# EAGLE design RFID-Feather (EAGLE 9.5.2)
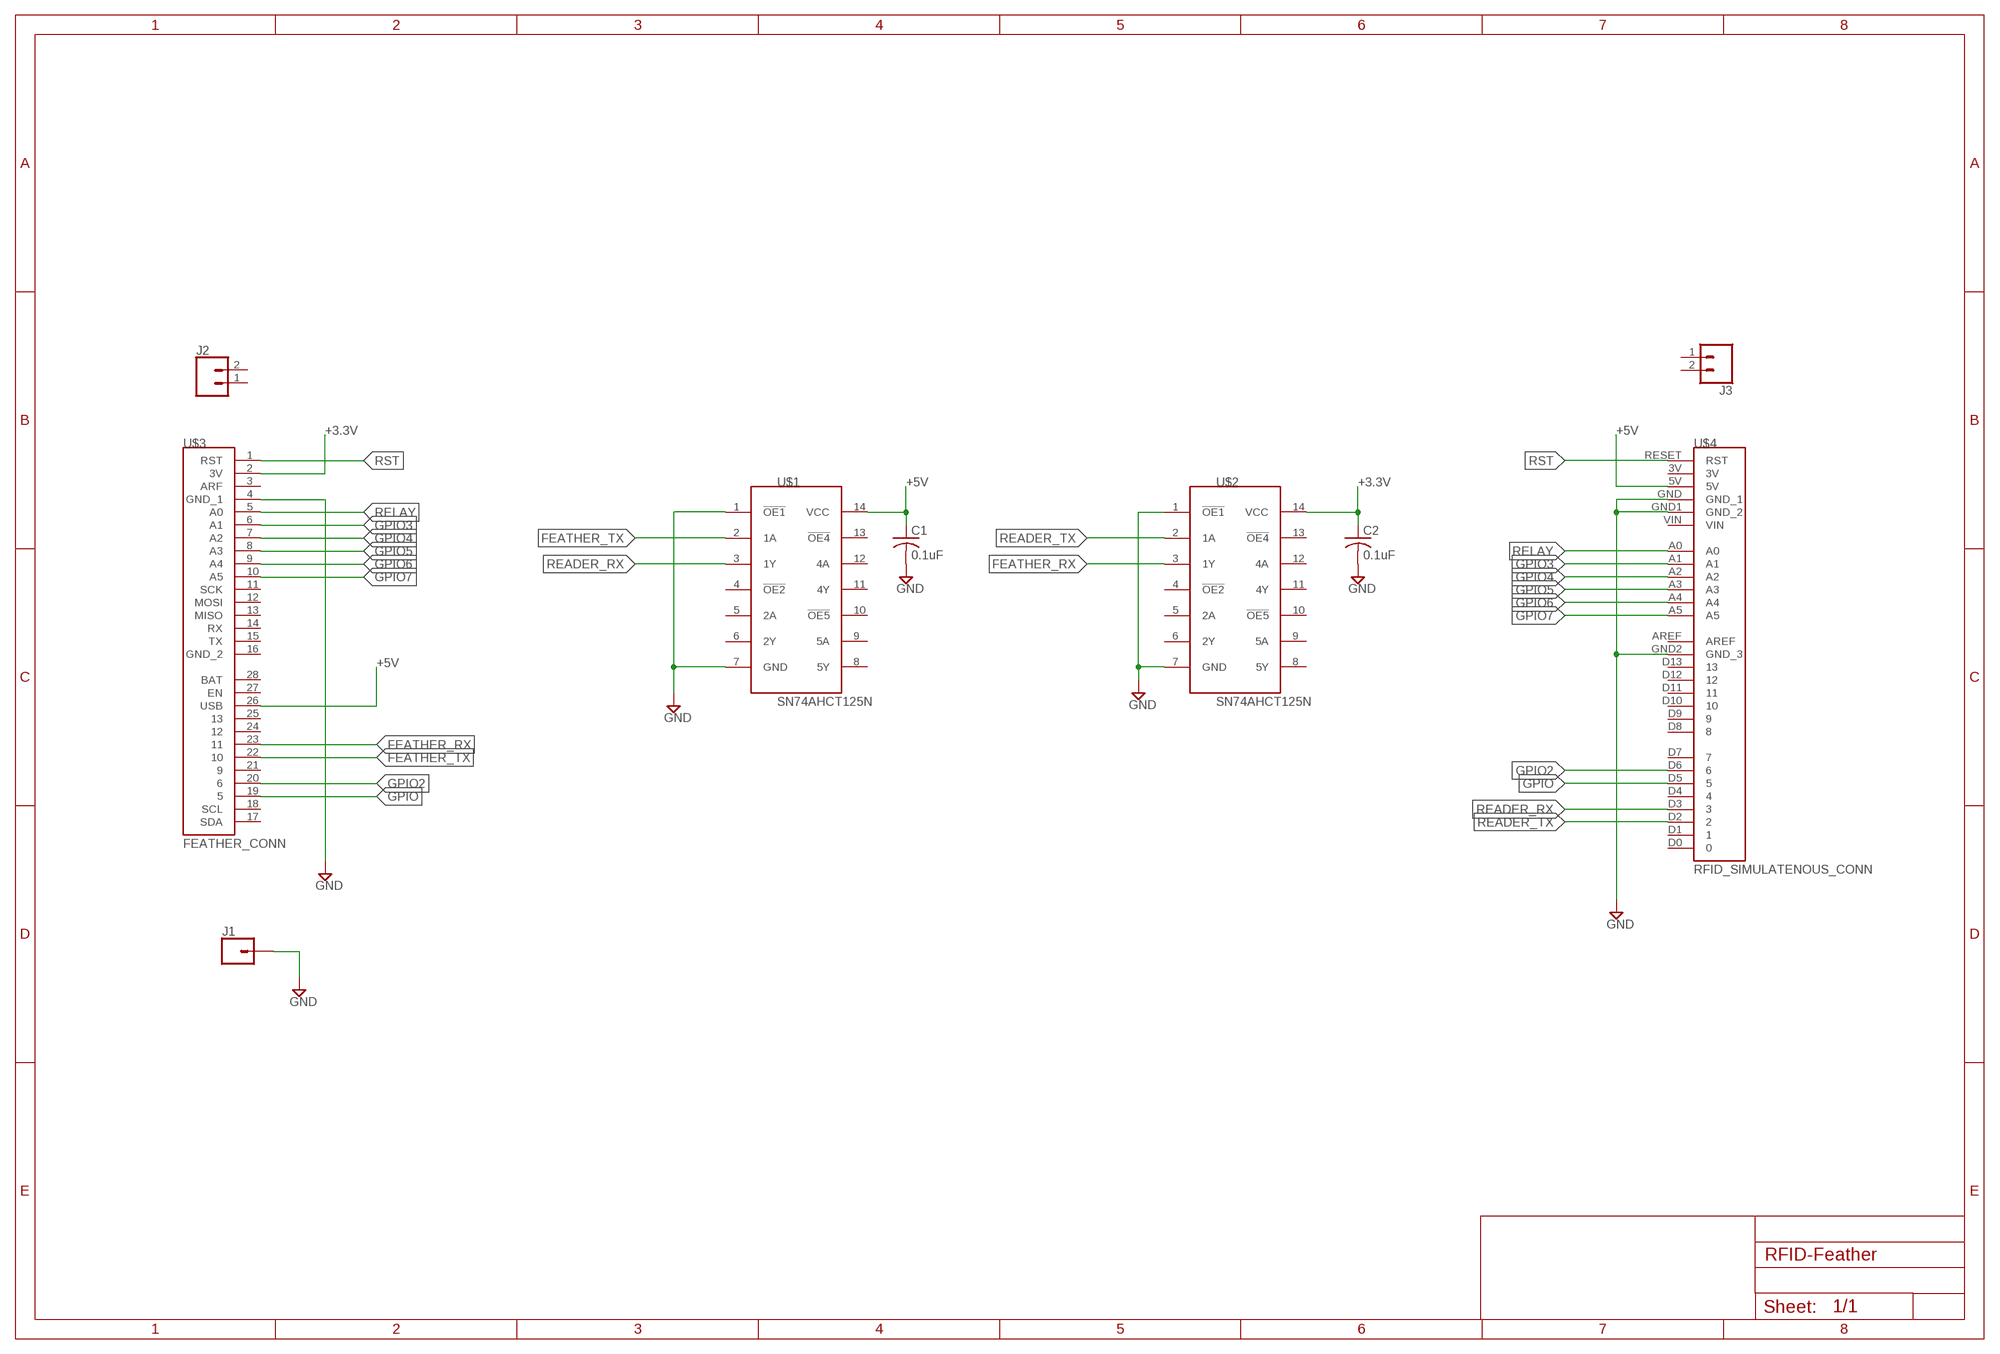
[diagram p0: schematic, sheet 1]

## Parts
C1  0.1uF  C-USC0805K  [C0805K]
C2  0.1uF  C-USC0805K  [C0805K]
J1  CONN_01PTH_2MM  [1X01_2MM]
J2  CONN_02  [1X02]
J3  CONN_02  [1X02]
U$1  SN74AHCT125N  [DIP254P762X508-14P]
U$2  SN74AHCT125N  [DIP254P762X508-14P]
U$3  FEATHER_CONN  [FEATHERWING]
U$4  RFID_SIMULATENOUS_CONN  [ARDUINO]

## Nets
+3.3V: C2.1 U$2.14(VCC) U$3.2(3V)
+5V: C1.1 U$1.14(VCC) U$3.26(USB) U$4.5V
FEATHER_RX: U$2.3(1Y) U$3.23
FEATHER_TX: U$1.2(1A) U$3.22
GND: C1.2 C2.2 J1.1 U$1.1(!OE1) U$1.7(GND) U$2.1(!OE1) U$2.7(GND) U$3.4(GND_1) U$4.GND1(GND_2) U$4.GND2(GND_3) U$4.GND(GND_1)
GPIO: U$3.19 U$4.D5
GPIO2: U$3.20 U$4.D6
GPIO3: U$3.6(A1) U$4.A1
GPIO4: U$3.7(A2) U$4.A2
GPIO5: U$3.8(A3) U$4.A3
GPIO6: U$3.9(A4) U$4.A4
GPIO7: U$3.10(A5) U$4.A5
READER_RX: U$1.3(1Y) U$4.D3
READER_TX: U$2.2(1A) U$4.D2
RELAY: U$3.5(A0) U$4.A0
RST: U$3.1(RST) U$4.RESET(RST)
Unconnected: J2.1 J2.2 J3.1 J3.2 U$1.4(!OE2) U$1.5(2A) U$1.6(2Y) U$1.8(5Y) U$1.9(5A) U$1.10(!OE5) U$1.11(4Y) U$1.12(4A) U$1.13(!OE4) U$2.4(!OE2) U$2.5(2A) U$2.6(2Y) U$2.8(5Y) U$2.9(5A) U$2.10(!OE5) U$2.11(4Y) U$2.12(4A) U$2.13(!OE4) U$3.3(ARF) U$3.11(SCK) U$3.12(MOSI) U$3.13(MISO) U$3.14(RX) U$3.15(TX) U$3.16(GND_2) U$3.17(SDA) U$3.18(SCL) U$3.21 U$3.24 U$3.25 U$3.27(EN) U$3.28(BAT) U$4.3V U$4.AREF U$4.D0 U$4.D1 U$4.D4 U$4.D7 U$4.D8 U$4.D9 U$4.D10 U$4.D11 U$4.D12 U$4.D13 U$4.VIN

## Library data of the parts
C1 C2 = adafruit:C-US: CAPACITOR, American symbol
J1 = SparkFun-Connectors:CONN_01: Single connection point. Often used as Generic Header-pin footprint for 0.1 inch spaced/style header connections On any of the 0.1 inch spaced packages, you can populate with these: Break Away Headers - Straight <https://www.sparkfun.com/products/116> (PRT-00116) Break Away Male Headers - Right Angle <https://www.sparkfun.com/products/553> (PRT-00553) Female Headers <https://www.sparkfun.com/products/115> (PRT-00115) Break Away Headers - Machine Pin <https://www.sparkfun.com/products/117> (PRT-00117) Break Away Female Headers - Swiss Machine Pin <https://www.sparkfun.com/products/743> (PRT-00743) This device is also useful as a general connection point to wire up your design to another part of your project. Our various solder wires solder well into these plated through hole pads. Hook-Up Wire - Assortment (Stranded, 22 AWG) <https://www.sparkfun.com/products/11375> (PRT-11375) Hook-Up Wire - Assortment (Solid Core, 22 AWG) <https://www.sparkfun.com/products/11367> (PRT-11367) View the entire wire category on our website here <https://www.sparkfun.com/categories/141> Special notes: SMTSO-256-ET is a "flush mount" nut for a 4-40 screw. We mostly use this on specialty testbeds; it is a nice way to connect hardware to your PCB at an adjustable hieght. Also note, the SNAP packages are for using a snappable style connector. We sell a baggie of snaps and they are also used on two LilyPad designs: Snap Assortment - 30 pack (male and female) <https://www.sparkfun.com/products/11347> (DEV-11347) LilyPad Arduino SimpleSnap <https://www.sparkfun.com/products/10941> (DEV-10941) LilyPad SimpleSnap Protoboard <https://www.sparkfun.com/products/10940> (DEV-10940)
J2 J3 = SparkFun-Connectors:CONN_02: Multi connection point. Often used as Generic Header-pin footprint for 0.1 inch spaced/style header connections On any of the 0.1 inch spaced packages, you can populate with these: Break Away Headers - Straight <https://www.sparkfun.com/products/116> (PRT-00116) Break Away Male Headers - Right Angle <https://www.sparkfun.com/products/553> (PRT-00553) Female Headers <https://www.sparkfun.com/products/115> (PRT-00115) Break Away Headers - Machine Pin <https://www.sparkfun.com/products/117> (PRT-00117) Break Away Female Headers - Swiss Machine Pin <https://www.sparkfun.com/products/743> (PRT-00743) For SCREWTERMINALS and SPRING TERMINALS visit here: Screw Terimnals on SparkFun.com <https://www.sparkfun.com/search/results?term=Screw+Terminals> (5mm/3.5mm/2.54mm spacing) This device is also useful as a general connection point to wire up your design to another part of your project. Our various solder wires solder well into these plated through hole pads. Hook-Up Wire - Assortment (Stranded, 22 AWG) <https://www.sparkfun.com/products/11375> (PRT-11375) Hook-Up Wire - Assortment (Solid Core, 22 AWG) <https://www.sparkfun.com/products/11367> (PRT-11367) View the entire wire category on our website here <https://www.sparkfun.com/categories/141> Special notes: Molex polarized connector foot print use with: PRT-08233 with associated crimp pins and housings. 2.54_SCREWTERM for use with PRT-10571. 3.5mm Screw Terminal footprints for PRT-08084 5mm Screw Terminal footprints for use with PRT-08432
U$1 U$2 = DIP254P762X508-14P:SN74AHCT125N
U$3 = FEATHER_FOOTPRINT:FEATHER_CONN
U$4 = FEATHER_FOOTPRINT:RFID_SIMULATENOUS_CONN

## Board
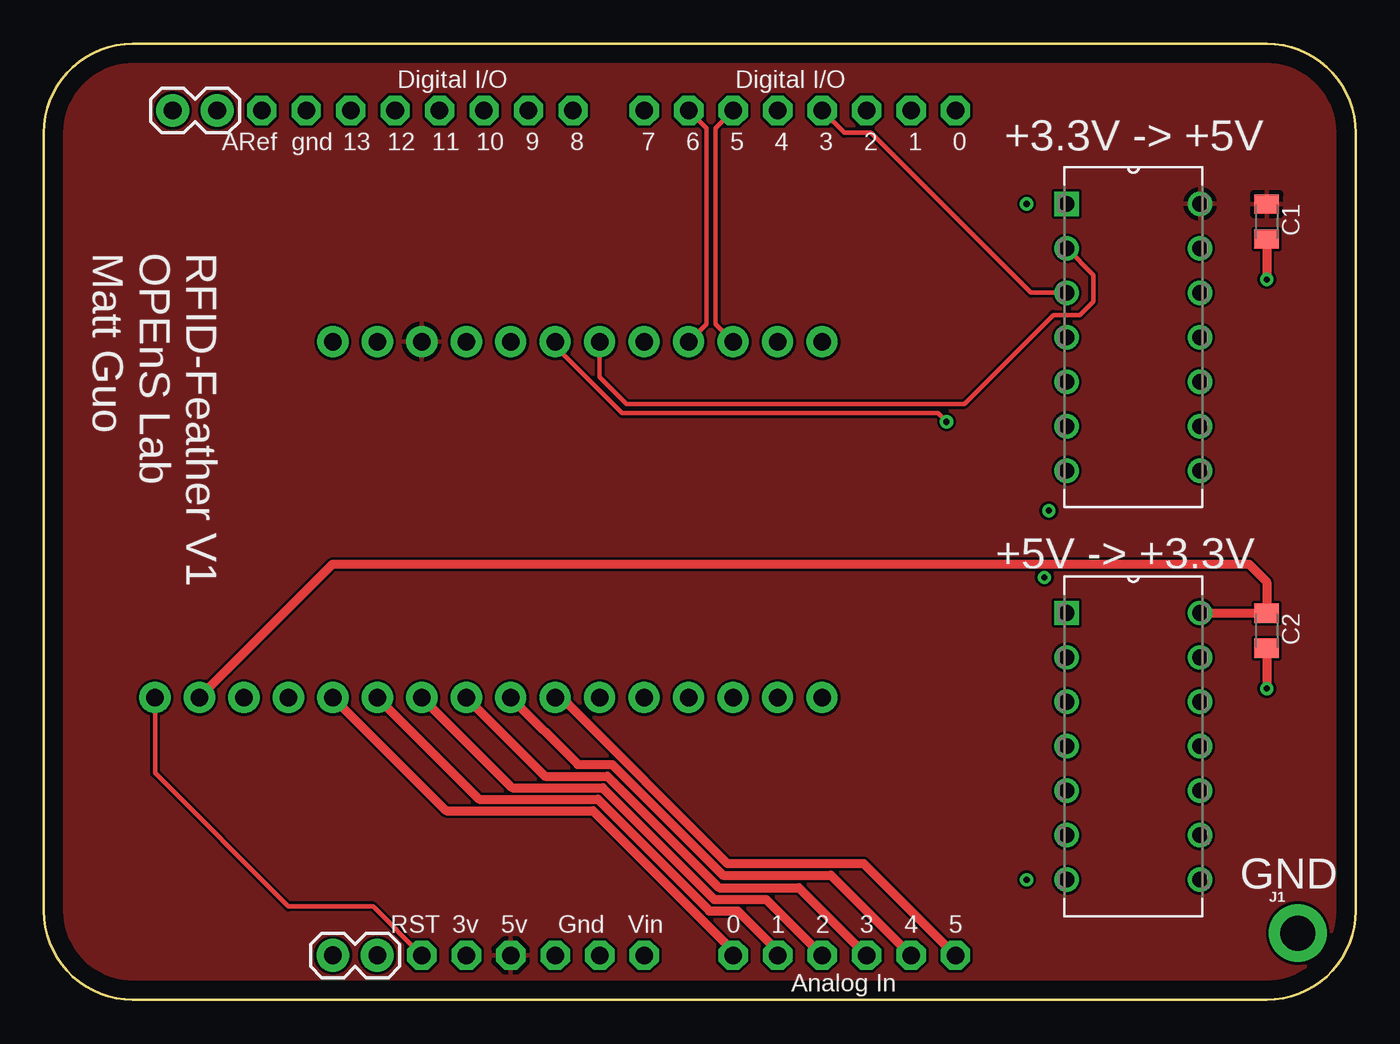
[diagram p1: board, top side]
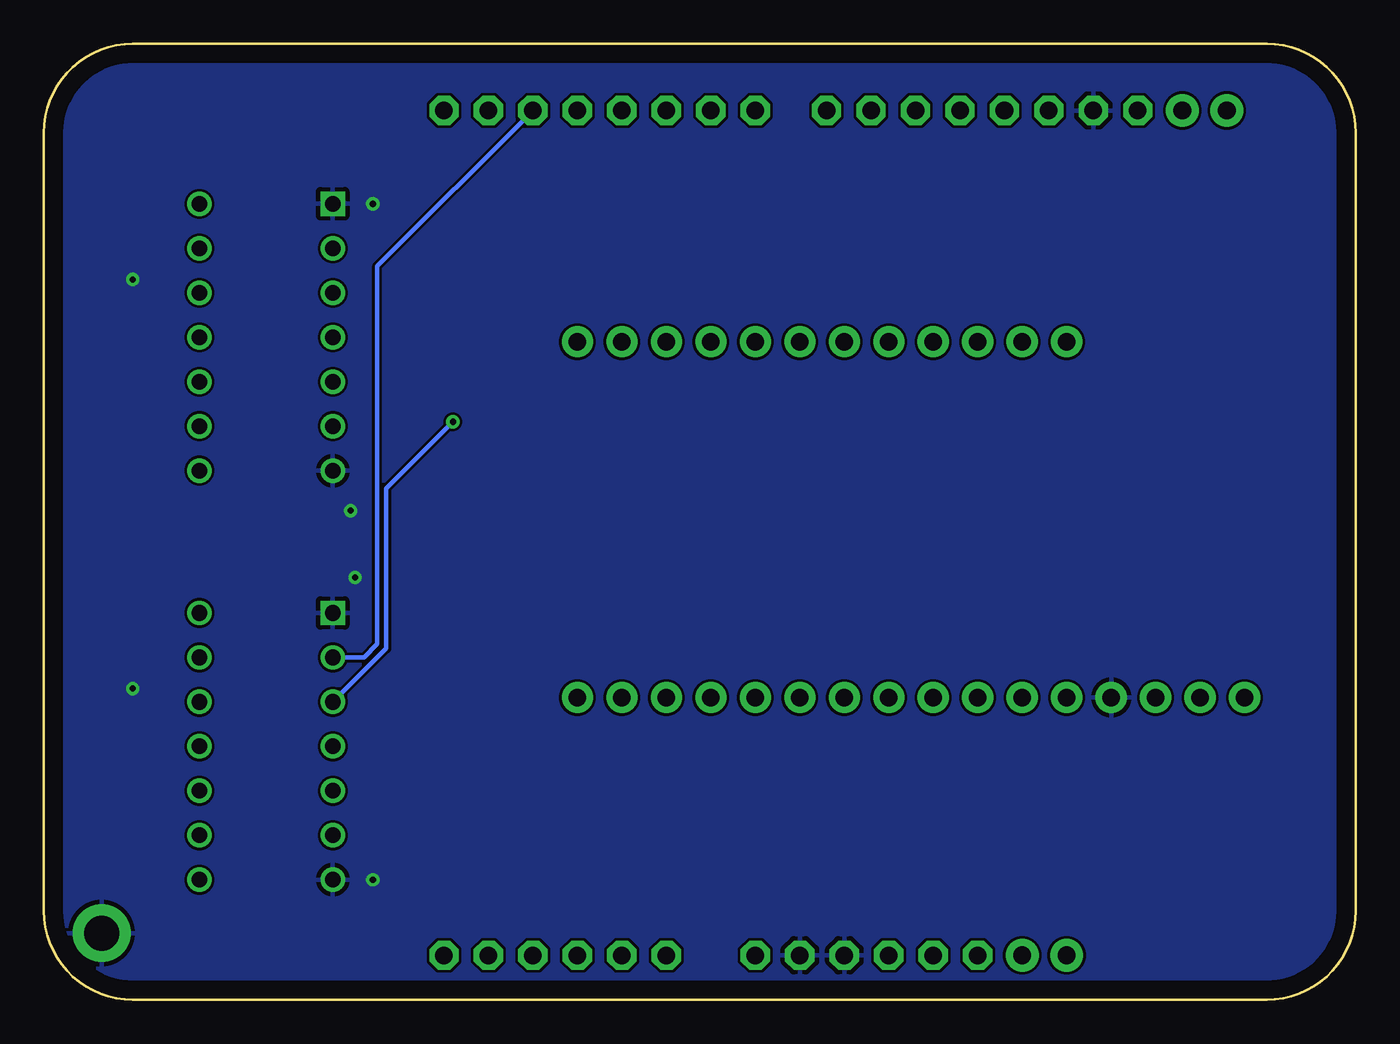
[diagram p2: board, bottom side, seen from below]

Size 74.93 x 54.61 mm. Coordinates in mm from the lower left corner, seen from the top.
Outline: 69.85,0 arc90 74.93,5.08 74.93,49.53 arc90 69.85,54.61 5.08,54.61 arc90 0,49.53 0,5.08 arc90 5.08,0 69.85,0
Copper layers (1*16): Top 0.035mm / dielectric 1.5mm / Bottom 0.035mm
Design rules "default *": minimum track width 6mil, minimum drill 0.35mm, track to track 6mil, track to pad 6mil, pad to pad 6mil, via to via 6mil, smd to smd 6mil, copper to edge 40mil, drill to drill 6mil, minimum pad ring 10mil, minimum via ring 8mil, stop-mask expansion 4mil, vias tented up to drill 30mil, thermal gap 10mil

### Footprints (pad centres in the part's own frame; a part is rotated, then mirrored left to right if it is on the bottom)
C0805K = smd 1.1 x 1.4: 1 -1,0; 2 1,0
1X01_2MM = drill 2 pad 3.302: 1 0,0
1X02 = drill 1.016 pad 1.88: 1 0,0; 2 2.54,0
DIP254P762X508-14P = drill 0.889 square: 1 -7.62,15.24 | drill 0.889: 2 -7.62,12.7; 3 -7.62,10.16; 4 -7.62,7.62; 5 -7.62,5.08; 6 -7.62,2.54; 7 -7.62,0; 8 0,0; 9 0,2.54; 10 0,5.08; 11 0,7.62; 12 0,10.16; 13 0,12.7; 14 0,15.24
FEATHERWING = drill 1 pad 1.778: 1 -13.97,1.27; 2 -11.43,1.27; 3 -8.89,1.27; 4 -6.35,1.27; 5 -3.81,1.27; 6 -1.27,1.27; 7 1.27,1.27; 8 3.81,1.27; 9 6.35,1.27; 10 8.89,1.27; 11 11.43,1.27; 12 13.97,1.27; 13 16.51,1.27; 14 19.05,1.27; 15 21.59,1.27; 16 24.13,1.27; 17 24.13,21.59; 18 21.59,21.59; 19 19.05,21.59; 20 16.51,21.59; 21 13.97,21.59; 22 11.43,21.59; 23 8.89,21.59; 24 6.35,21.59; 25 3.81,21.59; 26 1.27,21.59; 27 -1.27,21.59; 28 -3.81,21.59
ARDUINO = drill 1 pad 1.676 octagon: 3V -41.91,2.54; 5V -39.37,2.54; A0 -26.67,2.54; A1 -24.13,2.54; A2 -21.59,2.54; A3 -19.05,2.54; A4 -16.51,2.54; A5 -13.97,2.54; AREF -53.594,50.8; D0 -13.97,50.8; D1 -16.51,50.8; D2 -19.05,50.8; D3 -21.59,50.8; D4 -24.13,50.8; D5 -26.67,50.8; D6 -29.21,50.8; D7 -31.75,50.8; D8 -35.814,50.8; D9 -38.354,50.8; D10 -40.894,50.8; D11 -43.434,50.8; D12 -45.974,50.8; D13 -48.514,50.8; GND -51.054,50.8; GND1 -34.29,2.54; GND2 -36.83,2.54; RESET -44.45,2.54; VIN -31.75,2.54

### Placement (x,y rotation side)
C1  69.85,44.45 270 top
C2  69.85,21.08 270 top
J1  71.63,3.81 0 top
J2  7.37,50.8 0 top
J3  16.51,2.54 0 top
U$1  66.04,30.23 0 top
U$2  66.04,6.86 0 top
U$3  20.32,16 0 top
U$4  66.04,0 0 top

### Tracks (layer width: path | path; a pad name or v marks a point on that pad's centre or on a via)
+3.3V
  Top 0.508: U$3.2 16.51,24.89 68.83,24.89 69.85,23.88 C2.1 66.06,22.08 U$2.14
+5V
  pour Top: -15.49,-6.35 83.31,-6.35 84.07,-5.59 84.07,59.44 83.82,59.69 -15.49,59.69
FEATHER_RX  (via drill 0.35)
  Top 0.254: U$3.23 29.21,37.34 33.02,33.53 51.05,33.53 v51.56,33.02
  Bottom 0.254: U$2.3 55.37,20.07 55.37,29.21 v51.56,33.02
FEATHER_TX
  Top 0.254: U$3.22 31.75,35.56 33.27,34.04 52.58,34.04 57.66,39.12 59.18,39.12 59.94,39.88 59.94,41.4 U$1.2
GND  (via drill 0.35)
  Top 0.508: C2.2 v69.85,17.78 | C1.2 v69.85,41.15
  other vias: 56.13,45.47 57.4,27.94 57.15,24.13 56.13,6.86
  pour Bottom: -3.81,58.93 -3.81,-5.59 78.23,-5.59 78.49,-5.33 78.49,58.93
GPIO
  Top 0.254: U$4.D5 38.35,49.78 38.35,38.61 U$3.19
GPIO2
  Top 0.254: U$4.D6 37.85,49.78 37.85,38.61 U$3.20
GPIO3
  Top 0.508: U$4.A1 41.91,2.79 39.62,5.08 38.02,5.08 31.64,11.46 24.87,11.46 U$3.6
GPIO4
  Top 0.508: U$4.A2 41.25,5.74 38.29,5.74 31.92,12.12 26.75,12.12 U$3.7
GPIO5
  Top 0.508: U$4.A3 43.13,6.4 38.57,6.4 32.19,12.78 28.63,12.78 U$3.8
GPIO6
  Top 0.508: U$3.9 30.5,13.44 32.46,13.44 38.79,7.11 44.96,7.11 U$4.A4
GPIO7
  Top 0.508: U$4.A5 46.84,7.77 39.06,7.77 29.56,17.27 U$3.10
READER_RX
  Top 0.254: U$1.3 56.39,40.39 47.24,49.53 45.72,49.53 U$4.D3
READER_TX
  Bottom 0.254: U$2.2 56.64,19.56 55.88,20.32 55.88,41.91 U$4.D2
RELAY
  Top 0.508: U$4.A0 39.37,2.79 31.37,10.79 22.99,10.79 U$3.5
RST
  Top 0.254: U$4.RESET 18.8,5.33 13.97,5.33 6.35,12.95 U$3.1

### Text on the board
tPlace: +3.3V -> +5V | RFID-Feather V1 / OPEnS Lab / Matt Guo | +5V -> +3.3V | GND